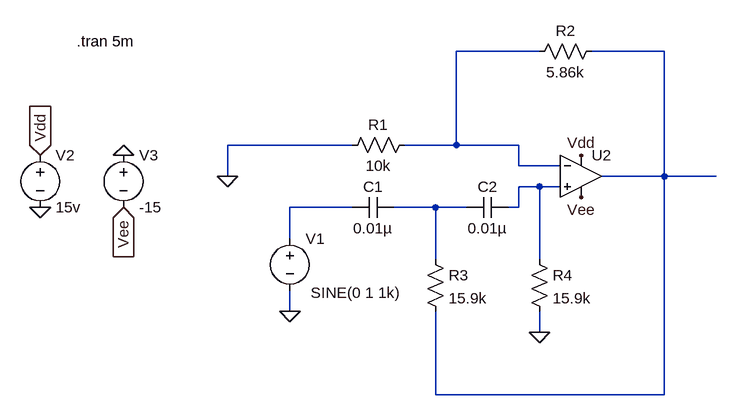
[diagram p0: schematic 2nd order.asc]
2nd order.asc, the LTspice schematic file:
Version 4
SHEET 1 960 680
WIRE 592 0 464 0
WIRE 784 0 672 0
WIRE 304 144 112 144
WIRE 464 144 464 0
WIRE 464 144 384 144
WIRE 560 144 464 144
WIRE 560 176 560 144
WIRE 624 176 560 176
WIRE 112 192 112 144
WIRE 784 192 784 0
WIRE 784 192 688 192
WIRE 864 192 784 192
WIRE 592 208 560 208
WIRE 624 208 592 208
WIRE 304 240 208 240
WIRE 432 240 368 240
WIRE 480 240 432 240
WIRE 560 240 560 208
WIRE 560 240 544 240
WIRE 208 288 208 240
WIRE 432 320 432 240
WIRE 592 320 592 208
WIRE 208 400 208 368
WIRE 592 432 592 400
WIRE 432 528 432 400
WIRE 784 528 784 192
WIRE 784 528 432 528
FLAG 592 432 0
FLAG -176 240 0
FLAG -176 160 Vdd
IOPIN -176 160 In
FLAG -48 240 Vee
IOPIN -48 240 In
FLAG 656 160 Vdd
FLAG 656 224 Vee
FLAG -48 160 0
FLAG 208 400 0
FLAG 112 192 0
SYMBOL Voltage 208 272 R0
WINDOW 123 24 118 Left 2
WINDOW 3 32 99 Left 2
SYMATTR InstName V1
SYMATTR Value SINE(0 1 1k)
SYMBOL Res 400 128 R90
WINDOW 0 0 56 VBottom 2
WINDOW 3 32 56 VTop 2
SYMATTR InstName R1
SYMATTR Value 10k
SYMBOL Cap 368 224 R90
WINDOW 0 0 32 VBottom 2
WINDOW 3 32 32 VTop 2
SYMATTR InstName C1
SYMATTR Value 0.01µ
SYMBOL Cap 544 224 R90
WINDOW 0 0 32 VBottom 2
WINDOW 3 32 32 VTop 2
SYMATTR InstName C2
SYMATTR Value 0.01µ
SYMBOL Res 688 -16 R90
WINDOW 0 0 56 VBottom 2
WINDOW 3 32 56 VTop 2
SYMATTR InstName R2
SYMATTR Value 5.86k
SYMBOL Res 416 304 R0
SYMATTR InstName R3
SYMATTR Value 15.9k
SYMBOL Res 576 304 R0
SYMATTR InstName R4
SYMATTR Value 15.9k
SYMBOL Voltage -176 144 R0
SYMATTR InstName V2
SYMATTR Value 15v
SYMBOL Voltage -48 144 R0
SYMATTR InstName V3
SYMATTR Value -15
SYMBOL OpAmps/UniversalOpAmp 656 192 R0
SYMATTR InstName U2
TEXT -120 -16 Left 2 !.tran 5m

The netlist it stands for:
* 2nd order.asc
V1 N004 0 SINE(0 1 1k)
R1 N001 0 10k
C1 N005 N004 0.01µ
C2 N003 N005 0.01µ
R2 N002 N001 5.86k
R3 N005 N002 15.9k
R4 N003 0 15.9k
V2 Vdd 0 15v
V3 0 Vee -15
XU2 N003 N001 Vdd Vee N002 level1 Avol=1Meg GBW=10Meg Vos=0 En=0 Enk=0 In=0 Ink=0 Rin=500Meg  ; pins In+ In- V+ V- OUT
.tran 5m
.lib UniversalOpAmp1.lib
.backanno
.end